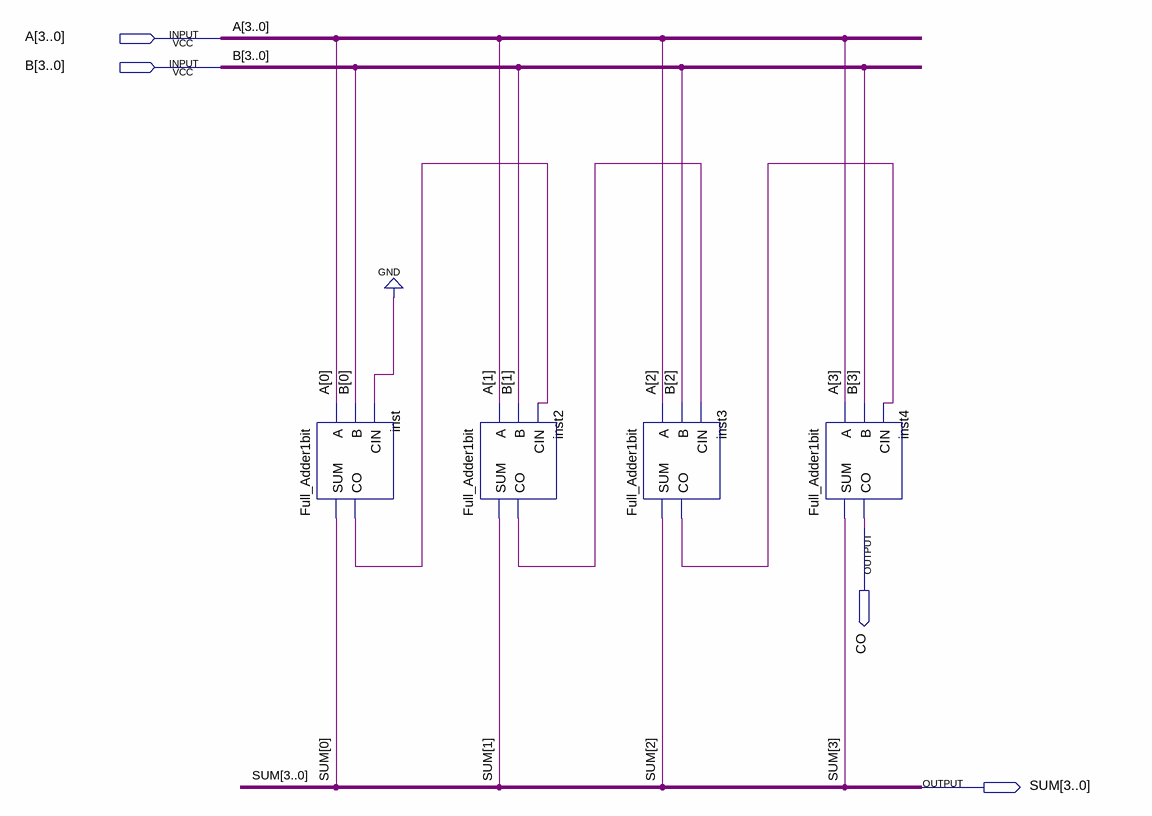
[diagram p0: schematic sheet]
// Quartus schematic Full_Adder4bits.bdf as structural Verilog: 4 symbols, 4 pins
module Full_Adder4bits (
  input  [3:0] A,
  input  [3:0] B,
  output CO,
  output [3:0] SUM
);

  wire inst2_co, inst3_co, inst_co;

  Full_Adder1bit inst (.A(A[0]), .B(B[0]), .CIN(1'b0), .SUM(SUM[0]), .CO(inst_co));
  Full_Adder1bit inst2 (.A(A[1]), .B(B[1]), .CIN(inst_co), .SUM(SUM[1]), .CO(inst2_co));
  Full_Adder1bit inst3 (.A(A[2]), .B(B[2]), .CIN(inst2_co), .SUM(SUM[2]), .CO(inst3_co));
  Full_Adder1bit inst4 (.A(A[3]), .B(B[3]), .CIN(inst3_co), .SUM(SUM[3]), .CO(CO));
endmodule
